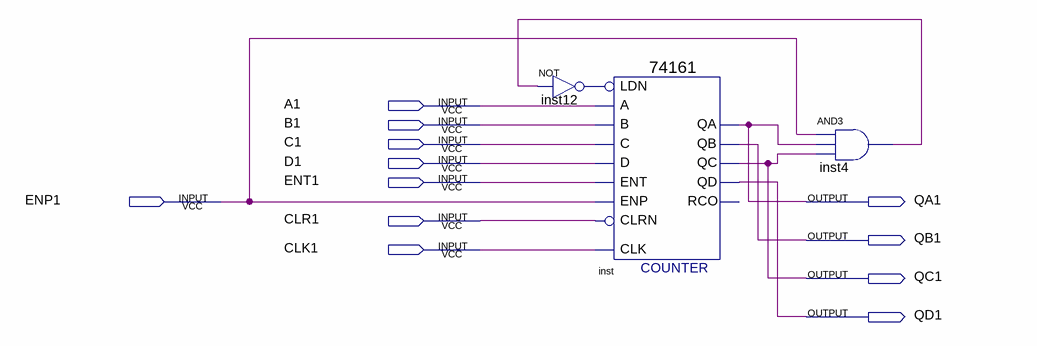
[diagram p0: schematic sheet]
// Quartus schematic Block2.bdf as structural Verilog: 3 symbols, 12 pins
module Block2 (
  input  A1,
  input  B1,
  input  C1,
  input  D1,
  input  ENT1,
  input  ENP1,
  input  CLR1,
  input  CLK1,
  output QA1,
  output QB1,
  output QC1,
  output QD1
);

  wire inst4_out, inst12_out;

  not inst12 (inst12_out, inst4_out);
  \74161  inst (
    .CLRN(CLR1), .CLK(CLK1), .ENP(ENP1), .LDN(inst12_out), .A(A1), .D(D1), .ENT(ENT1), .B(B1), .C(C1),
    .QD(QD1), .QC(QC1), .QB(QB1), .QA(QA1));  // open: RCO
  and inst4 (inst4_out, ENP1, QA1, QC1);
endmodule
